# Altium schematic sheet PLEN_Control_Logic_pt1.SchDoc
size 594 x 840 mm; Author: ALTIUM GOSTBOM2.0 KEV
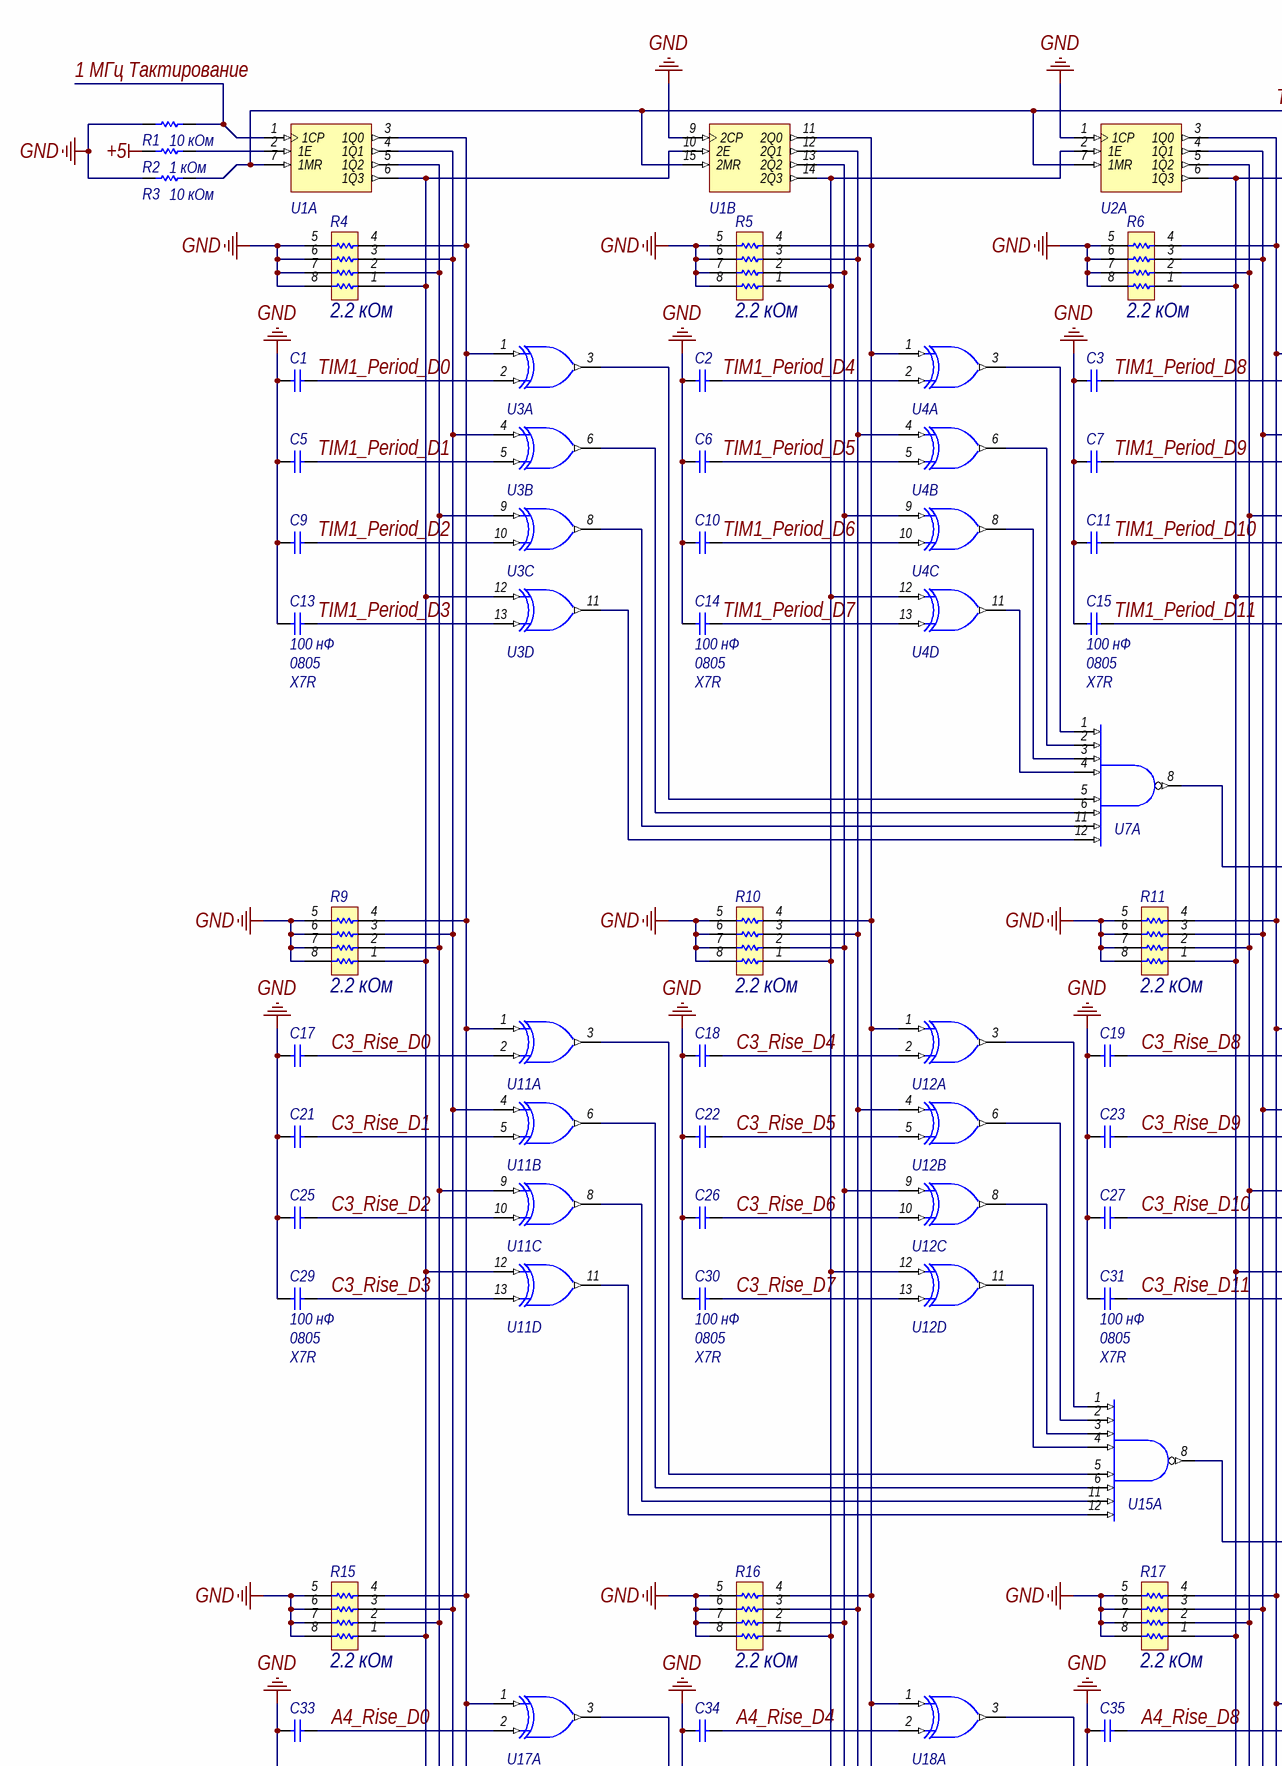
[diagram p0: PLEN_Control_Logic_pt1.SchDoc, top left]
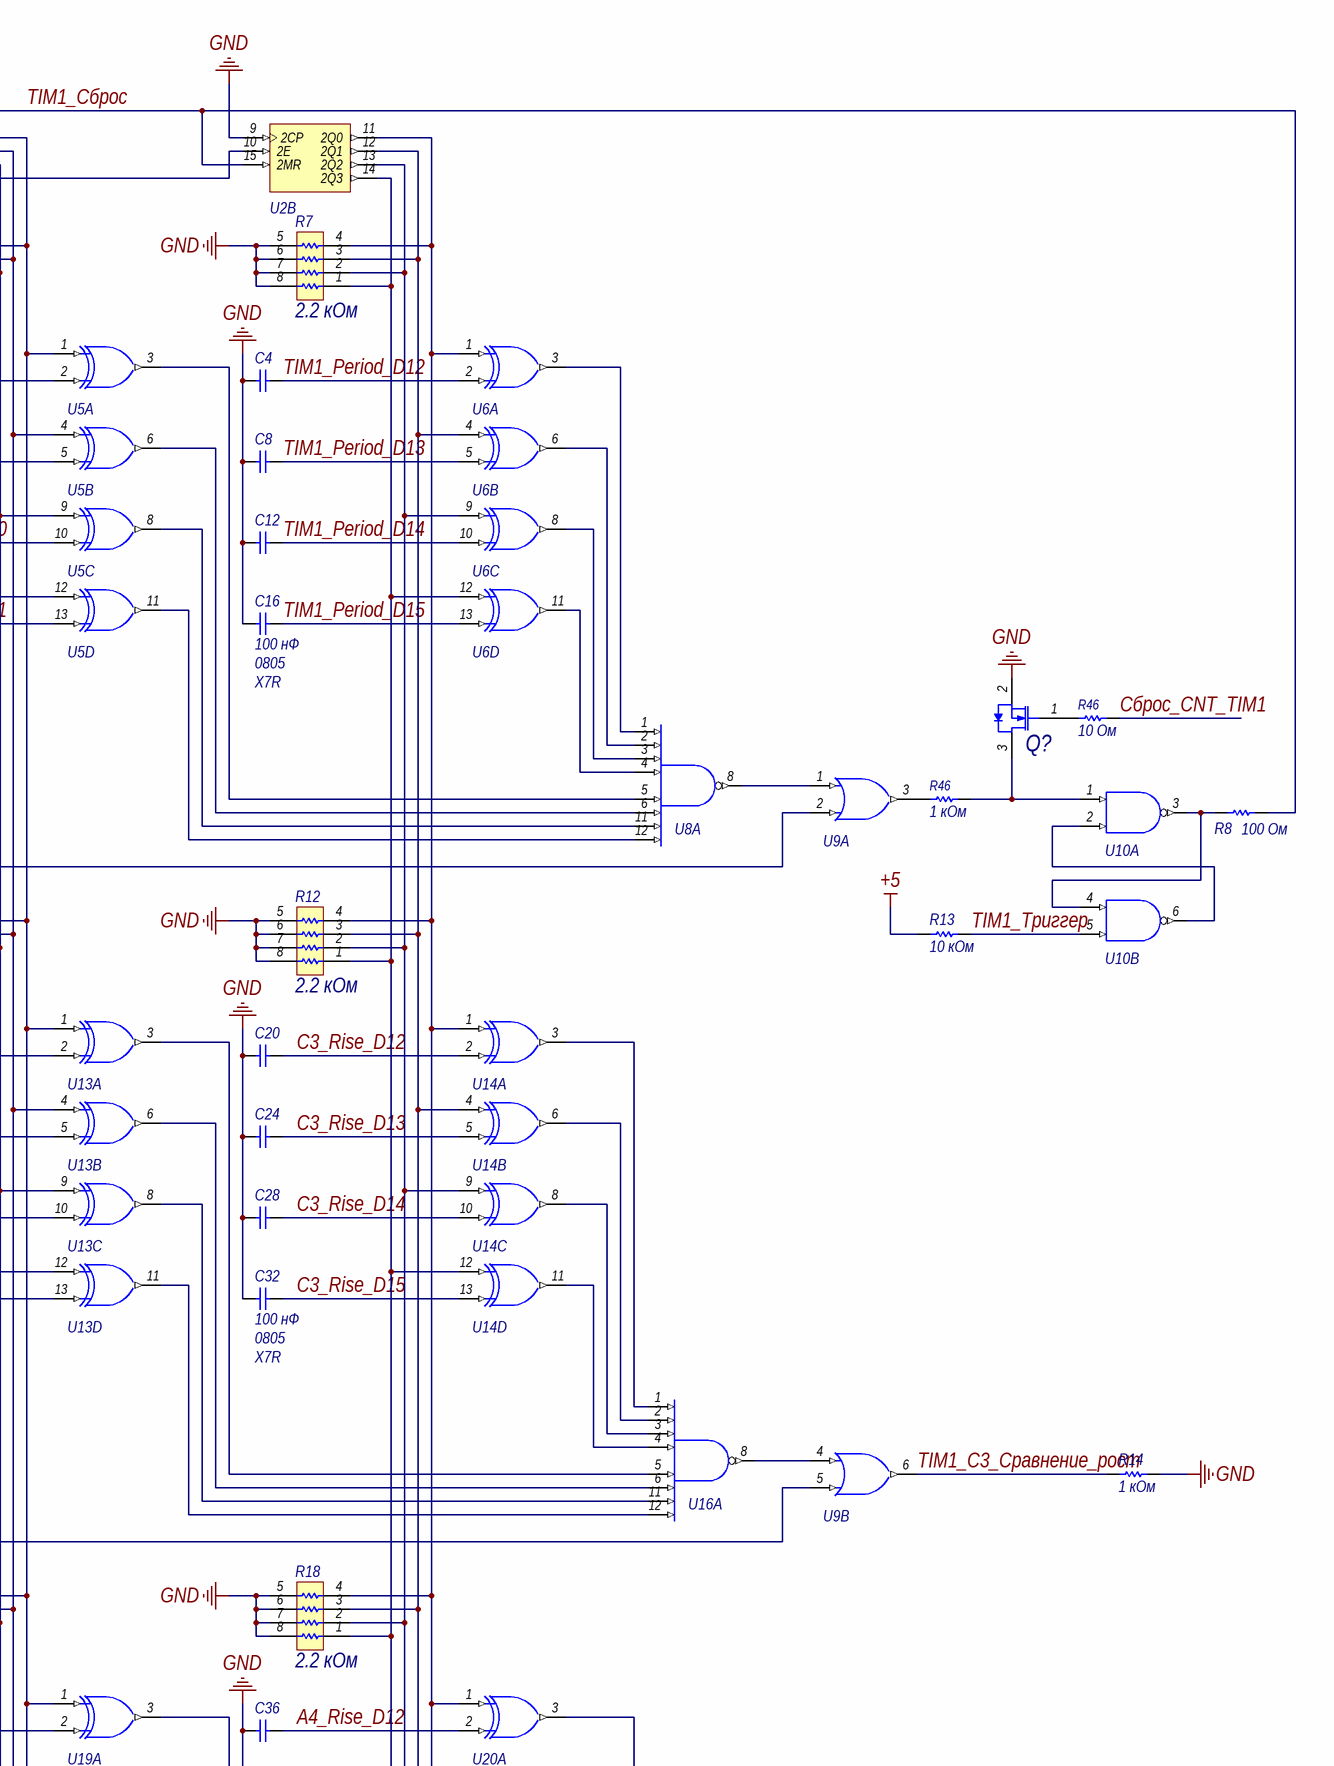
[diagram p1: PLEN_Control_Logic_pt1.SchDoc, top right]
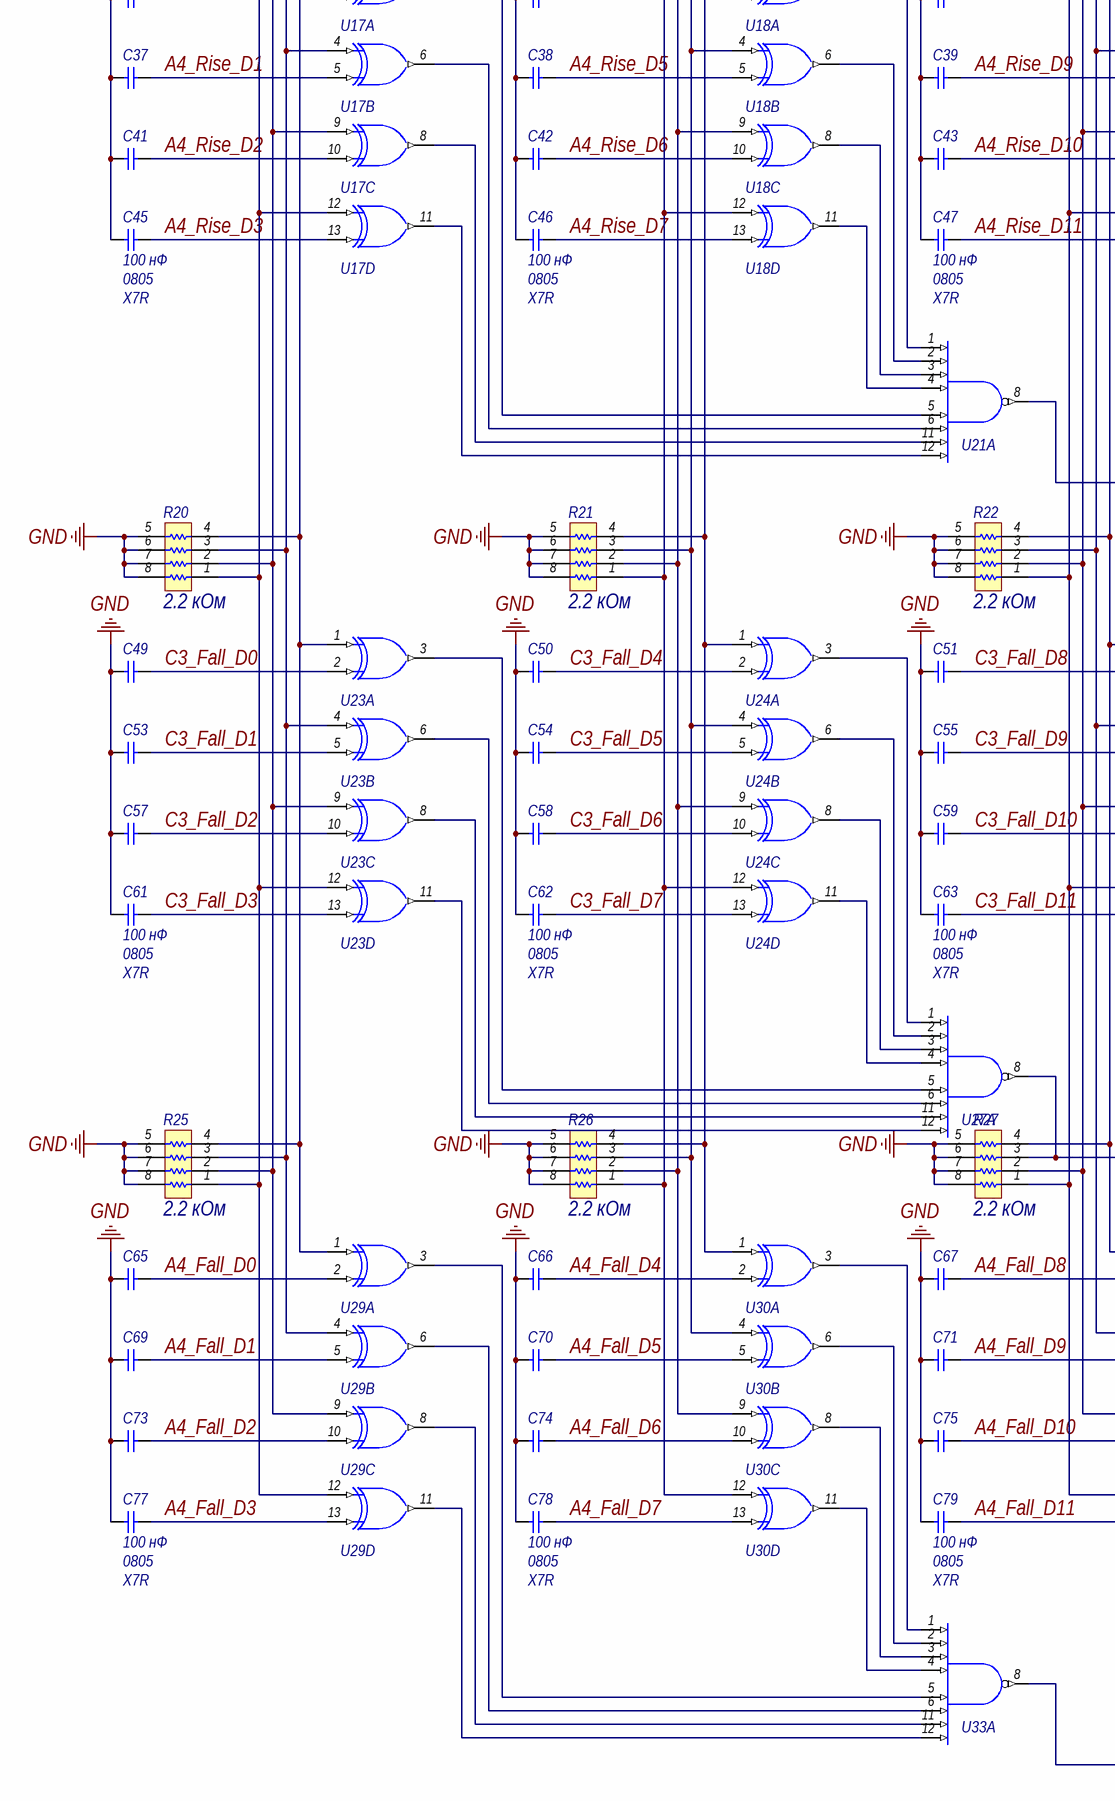
[diagram p2: PLEN_Control_Logic_pt1.SchDoc, bottom left]
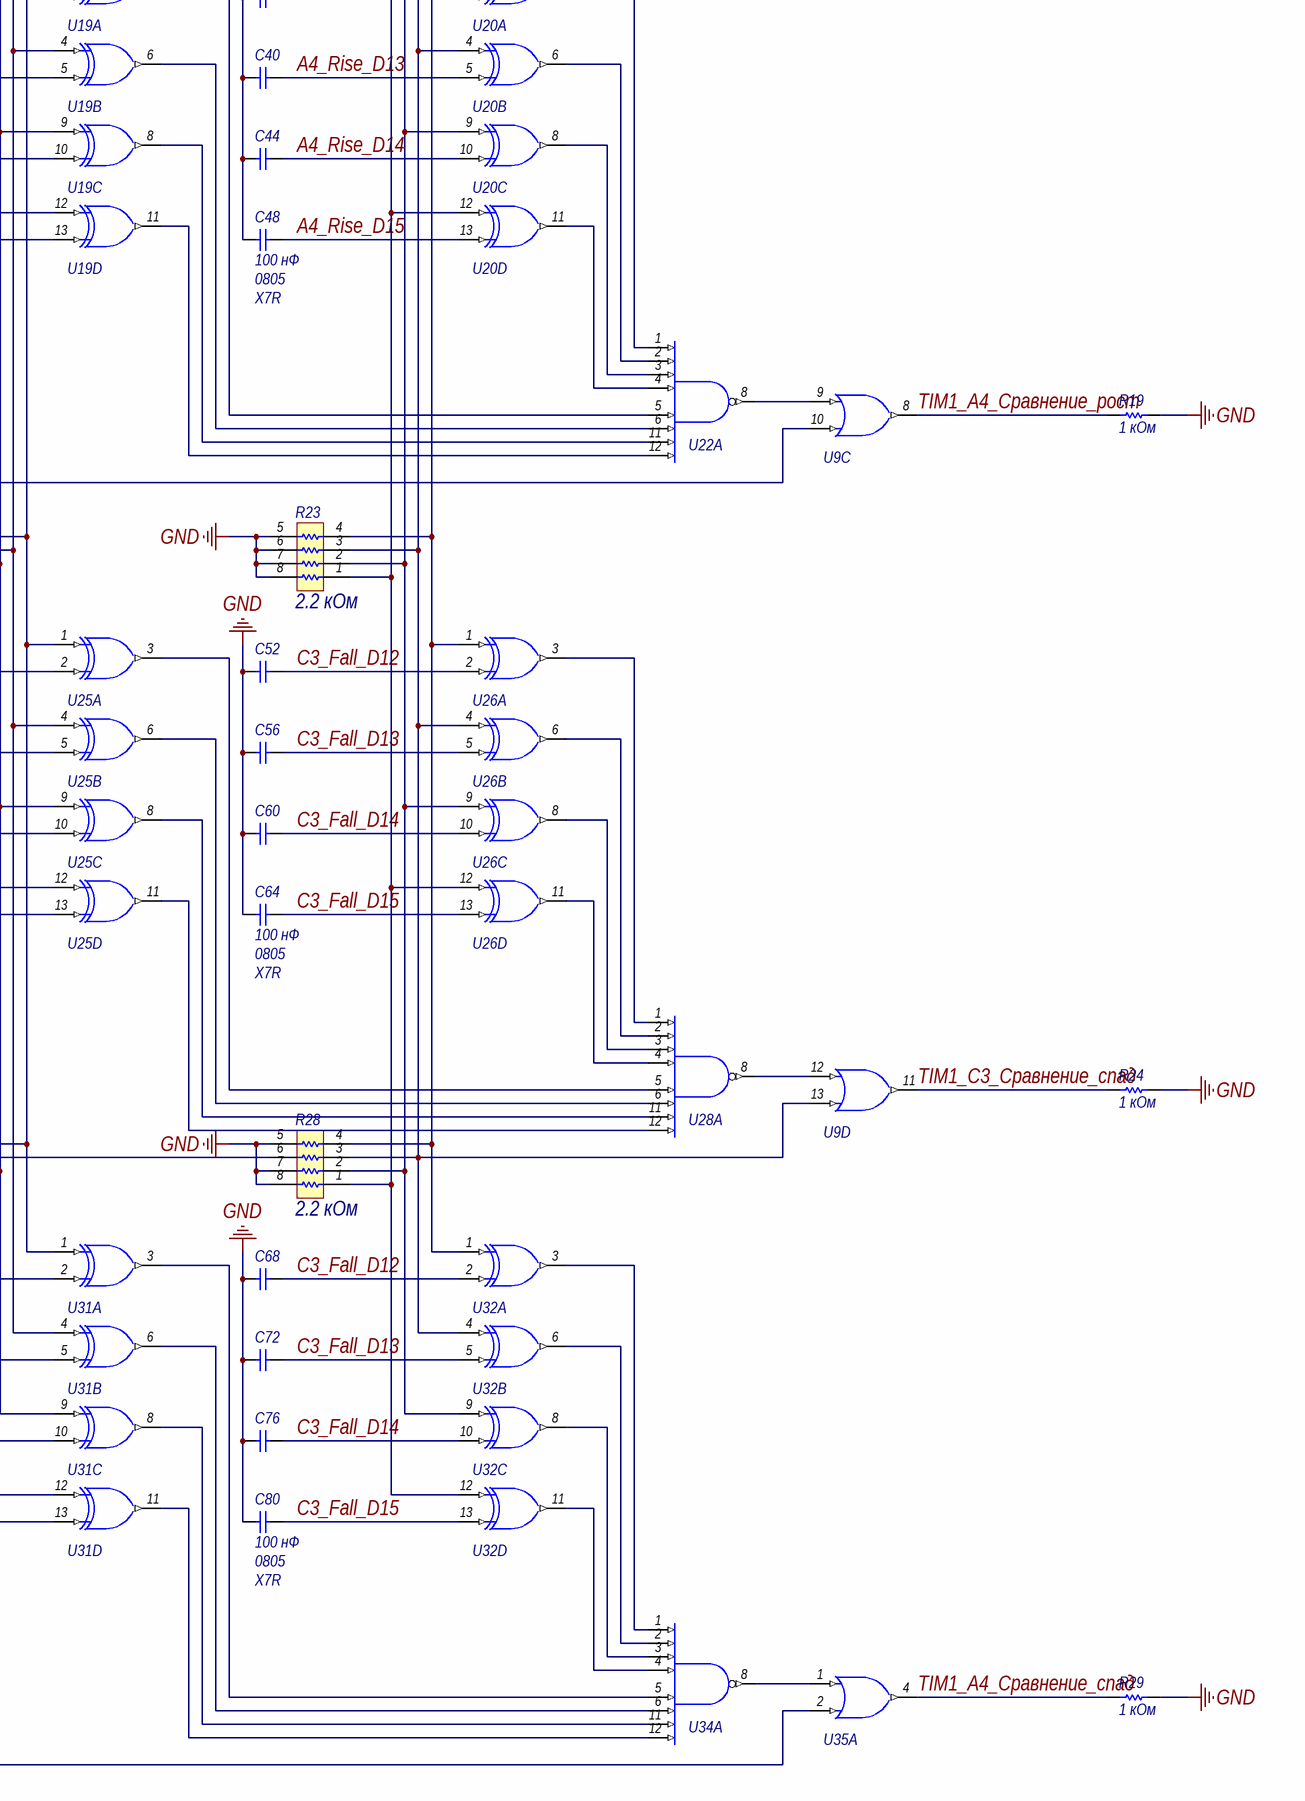
[diagram p3: PLEN_Control_Logic_pt1.SchDoc, bottom right]

## Parts
(Parts that share a designator on the sheet are numbered #1, #2 ... from top to bottom, then left to right.)
C1  C0805C105K3RACTU  [CAPC2013X140X50LL20T25]  (value not drawn)
C2  C0805C105K3RACTU  [CAPC2013X140X50LL20T25]  (value not drawn)
C3  C0805C105K3RACTU  [CAPC2013X140X50LL20T25]  (value not drawn)
C4  C0805C105K3RACTU  [CAPC2013X140X50LL20T25]  (value not drawn)
C5  C0805C105K3RACTU  [CAPC2013X140X50LL20T25]  (value not drawn)
C6  C0805C105K3RACTU  [CAPC2013X140X50LL20T25]  (value not drawn)
C7  C0805C105K3RACTU  [CAPC2013X140X50LL20T25]  (value not drawn)
C8  C0805C105K3RACTU  [CAPC2013X140X50LL20T25]  (value not drawn)
C9  C0805C105K3RACTU  [CAPC2013X140X50LL20T25]  (value not drawn)
C10  C0805C105K3RACTU  [CAPC2013X140X50LL20T25]  (value not drawn)
C11  C0805C105K3RACTU  [CAPC2013X140X50LL20T25]  (value not drawn)
C12  C0805C105K3RACTU  [CAPC2013X140X50LL20T25]  (value not drawn)
C13  value 100 нФ  Case: 0805  Dielectric: X7R  [CAPC2013X140X50LL20T25]  (hidden comment: C0805C105K3RACTU)
C14  value 100 нФ  Case: 0805  Dielectric: X7R  [CAPC2013X140X50LL20T25]  (hidden comment: C0805C105K3RACTU)
C15  value 100 нФ  Case: 0805  Dielectric: X7R  [CAPC2013X140X50LL20T25]  (hidden comment: C0805C105K3RACTU)
C16  value 100 нФ  Case: 0805  Dielectric: X7R  [CAPC2013X140X50LL20T25]  (hidden comment: C0805C105K3RACTU)
C17  C0805C105K3RACTU  [CAPC2013X140X50LL20T25]  (value not drawn)
C18  C0805C105K3RACTU  [CAPC2013X140X50LL20T25]  (value not drawn)
C19  C0805C105K3RACTU  [CAPC2013X140X50LL20T25]  (value not drawn)
C20  C0805C105K3RACTU  [CAPC2013X140X50LL20T25]  (value not drawn)
C21  C0805C105K3RACTU  [CAPC2013X140X50LL20T25]  (value not drawn)
C22  C0805C105K3RACTU  [CAPC2013X140X50LL20T25]  (value not drawn)
C23  C0805C105K3RACTU  [CAPC2013X140X50LL20T25]  (value not drawn)
C24  C0805C105K3RACTU  [CAPC2013X140X50LL20T25]  (value not drawn)
C25  C0805C105K3RACTU  [CAPC2013X140X50LL20T25]  (value not drawn)
C26  C0805C105K3RACTU  [CAPC2013X140X50LL20T25]  (value not drawn)
C27  C0805C105K3RACTU  [CAPC2013X140X50LL20T25]  (value not drawn)
C28  C0805C105K3RACTU  [CAPC2013X140X50LL20T25]  (value not drawn)
C29  value 100 нФ  Case: 0805  Dielectric: X7R  [CAPC2013X140X50LL20T25]  (hidden comment: C0805C105K3RACTU)
C30  value 100 нФ  Case: 0805  Dielectric: X7R  [CAPC2013X140X50LL20T25]  (hidden comment: C0805C105K3RACTU)
C31  value 100 нФ  Case: 0805  Dielectric: X7R  [CAPC2013X140X50LL20T25]  (hidden comment: C0805C105K3RACTU)
C32  value 100 нФ  Case: 0805  Dielectric: X7R  [CAPC2013X140X50LL20T25]  (hidden comment: C0805C105K3RACTU)
C33  C0805C105K3RACTU  [CAPC2013X140X50LL20T25]  (value not drawn)
C34  C0805C105K3RACTU  [CAPC2013X140X50LL20T25]  (value not drawn)
C35  C0805C105K3RACTU  [CAPC2013X140X50LL20T25]  (value not drawn)
C36  C0805C105K3RACTU  [CAPC2013X140X50LL20T25]  (value not drawn)
C37  C0805C105K3RACTU  [CAPC2013X140X50LL20T25]  (value not drawn)
C38  C0805C105K3RACTU  [CAPC2013X140X50LL20T25]  (value not drawn)
C39  C0805C105K3RACTU  [CAPC2013X140X50LL20T25]  (value not drawn)
C40  C0805C105K3RACTU  [CAPC2013X140X50LL20T25]  (value not drawn)
C41  C0805C105K3RACTU  [CAPC2013X140X50LL20T25]  (value not drawn)
C42  C0805C105K3RACTU  [CAPC2013X140X50LL20T25]  (value not drawn)
C43  C0805C105K3RACTU  [CAPC2013X140X50LL20T25]  (value not drawn)
C44  C0805C105K3RACTU  [CAPC2013X140X50LL20T25]  (value not drawn)
C45  value 100 нФ  Case: 0805  Dielectric: X7R  [CAPC2013X140X50LL20T25]  (hidden comment: C0805C105K3RACTU)
C46  value 100 нФ  Case: 0805  Dielectric: X7R  [CAPC2013X140X50LL20T25]  (hidden comment: C0805C105K3RACTU)
C47  value 100 нФ  Case: 0805  Dielectric: X7R  [CAPC2013X140X50LL20T25]  (hidden comment: C0805C105K3RACTU)
C48  value 100 нФ  Case: 0805  Dielectric: X7R  [CAPC2013X140X50LL20T25]  (hidden comment: C0805C105K3RACTU)
C49  C0805C105K3RACTU  [CAPC2013X140X50LL20T25]  (value not drawn)
C50  C0805C105K3RACTU  [CAPC2013X140X50LL20T25]  (value not drawn)
C51  C0805C105K3RACTU  [CAPC2013X140X50LL20T25]  (value not drawn)
C52  C0805C105K3RACTU  [CAPC2013X140X50LL20T25]  (value not drawn)
C53  C0805C105K3RACTU  [CAPC2013X140X50LL20T25]  (value not drawn)
C54  C0805C105K3RACTU  [CAPC2013X140X50LL20T25]  (value not drawn)
C55  C0805C105K3RACTU  [CAPC2013X140X50LL20T25]  (value not drawn)
C56  C0805C105K3RACTU  [CAPC2013X140X50LL20T25]  (value not drawn)
C57  C0805C105K3RACTU  [CAPC2013X140X50LL20T25]  (value not drawn)
C58  C0805C105K3RACTU  [CAPC2013X140X50LL20T25]  (value not drawn)
C59  C0805C105K3RACTU  [CAPC2013X140X50LL20T25]  (value not drawn)
C60  C0805C105K3RACTU  [CAPC2013X140X50LL20T25]  (value not drawn)
C61  value 100 нФ  Case: 0805  Dielectric: X7R  [CAPC2013X140X50LL20T25]  (hidden comment: C0805C105K3RACTU)
C62  value 100 нФ  Case: 0805  Dielectric: X7R  [CAPC2013X140X50LL20T25]  (hidden comment: C0805C105K3RACTU)
C63  value 100 нФ  Case: 0805  Dielectric: X7R  [CAPC2013X140X50LL20T25]  (hidden comment: C0805C105K3RACTU)
C64  value 100 нФ  Case: 0805  Dielectric: X7R  [CAPC2013X140X50LL20T25]  (hidden comment: C0805C105K3RACTU)
C65  C0805C105K3RACTU  [CAPC2013X140X50LL20T25]  (value not drawn)
C66  C0805C105K3RACTU  [CAPC2013X140X50LL20T25]  (value not drawn)
C67  C0805C105K3RACTU  [CAPC2013X140X50LL20T25]  (value not drawn)
C68  C0805C105K3RACTU  [CAPC2013X140X50LL20T25]  (value not drawn)
C69  C0805C105K3RACTU  [CAPC2013X140X50LL20T25]  (value not drawn)
C70  C0805C105K3RACTU  [CAPC2013X140X50LL20T25]  (value not drawn)
C71  C0805C105K3RACTU  [CAPC2013X140X50LL20T25]  (value not drawn)
C72  C0805C105K3RACTU  [CAPC2013X140X50LL20T25]  (value not drawn)
C73  C0805C105K3RACTU  [CAPC2013X140X50LL20T25]  (value not drawn)
C74  C0805C105K3RACTU  [CAPC2013X140X50LL20T25]  (value not drawn)
C75  C0805C105K3RACTU  [CAPC2013X140X50LL20T25]  (value not drawn)
C76  C0805C105K3RACTU  [CAPC2013X140X50LL20T25]  (value not drawn)
C77  value 100 нФ  Case: 0805  Dielectric: X7R  [CAPC2013X140X50LL20T25]  (hidden comment: C0805C105K3RACTU)
C78  value 100 нФ  Case: 0805  Dielectric: X7R  [CAPC2013X140X50LL20T25]  (hidden comment: C0805C105K3RACTU)
C79  value 100 нФ  Case: 0805  Dielectric: X7R  [CAPC2013X140X50LL20T25]  (hidden comment: C0805C105K3RACTU)
C80  value 100 нФ  Case: 0805  Dielectric: X7R  [CAPC2013X140X50LL20T25]  (hidden comment: C0805C105K3RACTU)
Q?  2N7002  [INF-PG-SOT23_N]  (value not drawn)
R1  value 10 кОм  [RESC2013X60X40ML20T25]  (hidden comment: ERA6AEB101V)
R2  value 1 кОм  [RESC2013X60X40ML20T25]  (hidden comment: ERA6AEB101V)
R3  value 10 кОм  [RESC2013X60X40ML20T25]  (hidden comment: ERA6AEB101V)
R4  value 2.2 кОм  [BOUR-CAT16-103J4LF_N]  (hidden comment: CAT16-103J4LF)
R5  value 2.2 кОм  [BOUR-CAT16-103J4LF_N]  (hidden comment: CAT16-103J4LF)
R6  value 2.2 кОм  [BOUR-CAT16-103J4LF_N]  (hidden comment: CAT16-103J4LF)
R7  value 2.2 кОм  [BOUR-CAT16-103J4LF_N]  (hidden comment: CAT16-103J4LF)
R8  value 100 Ом  [RESC2013X60X40ML20T25]  (hidden comment: ERA6AEB101V)
R9  value 2.2 кОм  [BOUR-CAT16-103J4LF_N]  (hidden comment: CAT16-103J4LF)
R10  value 2.2 кОм  [BOUR-CAT16-103J4LF_N]  (hidden comment: CAT16-103J4LF)
R11  value 2.2 кОм  [BOUR-CAT16-103J4LF_N]  (hidden comment: CAT16-103J4LF)
R12  value 2.2 кОм  [BOUR-CAT16-103J4LF_N]  (hidden comment: CAT16-103J4LF)
R13  value 10 кОм  [RESC2013X60X40ML20T25]  (hidden comment: ERA6AEB101V)
R14  value 1 кОм  [RESC2013X60X40ML20T25]  (hidden comment: ERA6AEB101V)
R15  value 2.2 кОм  [BOUR-CAT16-103J4LF_N]  (hidden comment: CAT16-103J4LF)
R16  value 2.2 кОм  [BOUR-CAT16-103J4LF_N]  (hidden comment: CAT16-103J4LF)
R17  value 2.2 кОм  [BOUR-CAT16-103J4LF_N]  (hidden comment: CAT16-103J4LF)
R18  value 2.2 кОм  [BOUR-CAT16-103J4LF_N]  (hidden comment: CAT16-103J4LF)
R19  value 1 кОм  [RESC2013X60X40ML20T25]  (hidden comment: ERA6AEB101V)
R20  value 2.2 кОм  [BOUR-CAT16-103J4LF_N]  (hidden comment: CAT16-103J4LF)
R21  value 2.2 кОм  [BOUR-CAT16-103J4LF_N]  (hidden comment: CAT16-103J4LF)
R22  value 2.2 кОм  [BOUR-CAT16-103J4LF_N]  (hidden comment: CAT16-103J4LF)
R23  value 2.2 кОм  [BOUR-CAT16-103J4LF_N]  (hidden comment: CAT16-103J4LF)
R24  value 1 кОм  [RESC2013X60X40ML20T25]  (hidden comment: ERA6AEB101V)
R25  value 2.2 кОм  [BOUR-CAT16-103J4LF_N]  (hidden comment: CAT16-103J4LF)
R26  value 2.2 кОм  [BOUR-CAT16-103J4LF_N]  (hidden comment: CAT16-103J4LF)
R27  value 2.2 кОм  [BOUR-CAT16-103J4LF_N]  (hidden comment: CAT16-103J4LF)
R28  value 2.2 кОм  [BOUR-CAT16-103J4LF_N]  (hidden comment: CAT16-103J4LF)
R29  value 1 кОм  [RESC2013X60X40ML20T25]  (hidden comment: ERA6AEB101V)
R46#1  value 10 Ом  [RESC2013X60X40ML20T25]  (hidden comment: ERA6AEB101V)
R46#2  value 1 кОм  [RESC2013X60X40ML20T25]  (hidden comment: ERA6AEB101V)
U1  CD74HC4520M  [D0016A_N]  (value not drawn)  (parts A,B of 3)
U2  CD74HC4520M  [D0016A_N]  (value not drawn)  (parts A,B of 3)
U3  SN74HC86D  [D0014A_N]  (value not drawn)  (parts A,B,C,D of 5)
U4  SN74HC86D  [D0014A_N]  (value not drawn)  (parts A,B,C,D of 5)
U5  SN74HC86D  [D0014A_N]  (value not drawn)  (parts A,B,C,D of 5)
U6  SN74HC86D  [D0014A_N]  (value not drawn)  (parts A,B,C,D of 5)
U7  CD74HC30M96  [D0014A_N]  (value not drawn)  (part A of 2)
U8  CD74HC30M96  [D0014A_N]  (value not drawn)  (part A of 2)
U9  SN74HC32DR  [D0014A_N]  (value not drawn)  (parts A,B,C,D of 5)
U10  SN74HC00DT  [D0014A_N]  (value not drawn)  (parts A,B of 5)
U11  SN74HC86D  [D0014A_N]  (value not drawn)  (parts A,B,C,D of 5)
U12  SN74HC86D  [D0014A_N]  (value not drawn)  (parts A,B,C,D of 5)
U13  SN74HC86D  [D0014A_N]  (value not drawn)  (parts A,B,C,D of 5)
U14  SN74HC86D  [D0014A_N]  (value not drawn)  (parts A,B,C,D of 5)
U15  CD74HC30M96  [D0014A_N]  (value not drawn)  (part A of 2)
U16  CD74HC30M96  [D0014A_N]  (value not drawn)  (part A of 2)
U17  SN74HC86D  [D0014A_N]  (value not drawn)  (parts A,B,C,D of 5)
U18  SN74HC86D  [D0014A_N]  (value not drawn)  (parts A,B,C,D of 5)
U19  SN74HC86D  [D0014A_N]  (value not drawn)  (parts A,B,C,D of 5)
U20  SN74HC86D  [D0014A_N]  (value not drawn)  (parts A,B,C,D of 5)
U21  CD74HC30M96  [D0014A_N]  (value not drawn)  (part A of 2)
U22  CD74HC30M96  [D0014A_N]  (value not drawn)  (part A of 2)
U23  SN74HC86D  [D0014A_N]  (value not drawn)  (parts A,B,C,D of 5)
U24  SN74HC86D  [D0014A_N]  (value not drawn)  (parts A,B,C,D of 5)
U25  SN74HC86D  [D0014A_N]  (value not drawn)  (parts A,B,C,D of 5)
U26  SN74HC86D  [D0014A_N]  (value not drawn)  (parts A,B,C,D of 5)
U27  CD74HC30M96  [D0014A_N]  (value not drawn)  (part A of 2)
U28  CD74HC30M96  [D0014A_N]  (value not drawn)  (part A of 2)
U29  SN74HC86D  [D0014A_N]  (value not drawn)  (parts A,B,C,D of 5)
U30  SN74HC86D  [D0014A_N]  (value not drawn)  (parts A,B,C,D of 5)
U31  SN74HC86D  [D0014A_N]  (value not drawn)  (parts A,B,C,D of 5)
U32  SN74HC86D  [D0014A_N]  (value not drawn)  (parts A,B,C,D of 5)
U33  CD74HC30M96  [D0014A_N]  (value not drawn)  (part A of 2)
U34  CD74HC30M96  [D0014A_N]  (value not drawn)  (part A of 2)
U35  SN74AHCT1G32DBVR  [DBV0005A_N]  (value not drawn)  (part A of 2)

## Nets
+5: R2.2 R13.1
GND: C1.2 C2.2 C3.2 C4.2 C5.2 C6.2 C7.2 C8.2 C9.2 C10.2 C11.2 C12.2 C13.2 C14.2 C15.2 C16.2 C17.2 C18.2 C19.2 C20.2 C21.2 C22.2 C23.2 C24.2 C25.2 C26.2 C27.2 C28.2 C29.2 C30.2 C31.2 C32.2 C33.2 C34.2 C35.2 C36.2 C37.2 C38.2 C39.2 C40.2 C41.2 C42.2 C43.2 C44.2 C45.2 C46.2 C47.2 C48.2 C49.2 C50.2 C51.2 C52.2 C53.2 C54.2 C55.2 C56.2 C57.2 C58.2 C59.2 C60.2 C61.2 C62.2 C63.2 C64.2 C65.2 C66.2 C67.2 C68.2 C69.2 C70.2 C71.2 C72.2 C73.2 C74.2 C75.2 C76.2 C77.2 C78.2 C79.2 C80.2 Q?.2(SOURCE) R1.2 R3.2 R4.5 R4.6 R4.7 R4.8 R5.5 R5.6 R5.7 R5.8 R6.5 R6.6 R6.7 R6.8 R7.5 R7.6 R7.7 R7.8 R9.5 R9.6 R9.7 R9.8 R10.5 R10.6 R10.7 R10.8 R11.5 R11.6 R11.7 R11.8 R12.5 R12.6 R12.7 R12.8 R14.2 R15.5 R15.6 R15.7 R15.8 R16.5 R16.6 R16.7 R16.8 R17.5 R17.6 R17.7 R17.8 R18.5 R18.6 R18.7 R18.8 R19.2 R20.5 R20.6 R20.7 R20.8 R21.5 R21.6 R21.7 R21.8 R22.5 R22.6 R22.7 R22.8 R23.5 R23.6 R23.7 R23.8 R24.2 R25.5 R25.6 R25.7 R25.8 R26.5 R26.6 R26.7 R26.8 R27.5 R27.6 R27.7 R27.8 R28.5 R28.7 R28.8 R29.2 U1.9(2CP) U2.1(1CP) U2.9(2CP)
1 МГц Тактирование: R1.1 U1.1(1CP)
A4_Rise_D0: C33.1 U17.2(1B)
A4_Rise_D1: C37.1 U17.5(2B)
A4_Rise_D2: C41.1 U17.10(3B)
A4_Rise_D3: C45.1 U17.13(4B)
A4_Rise_D4: C34.1 U18.2(1B)
A4_Rise_D5: C38.1 U18.5(2B)
A4_Rise_D6: C42.1 U18.10(3B)
A4_Rise_D7: C46.1 U18.13(4B)
A4_Rise_D8: C35.1 U19.2(1B)
A4_Rise_D9: C39.1 U19.5(2B)
A4_Rise_D10: C43.1 U19.10(3B)
A4_Rise_D11: C47.1 U19.13(4B)
A4_Rise_D12: C36.1 U20.2(1B)
A4_Rise_D13: C40.1 U20.5(2B)
A4_Rise_D14: C44.1 U20.10(3B)
A4_Rise_D15: C48.1 U20.13(4B)
C3_Rise_D0: C17.1 U11.2(1B)
C3_Rise_D1: C21.1 U11.5(2B)
C3_Rise_D2: C25.1 U11.10(3B)
C3_Rise_D3: C29.1 U11.13(4B)
C3_Rise_D4: C18.1 U12.2(1B)
C3_Rise_D5: C22.1 U12.5(2B)
C3_Rise_D6: C26.1 U12.10(3B)
C3_Rise_D7: C30.1 U12.13(4B)
C3_Rise_D8: C19.1 U13.2(1B)
C3_Rise_D9: C23.1 U13.5(2B)
C3_Rise_D10: C27.1 U13.10(3B)
C3_Rise_D11: C31.1 U13.13(4B)
C3_Rise_D12: C20.1 U14.2(1B)
C3_Rise_D13: C24.1 U14.5(2B)
C3_Rise_D14: C28.1 U14.10(3B)
C3_Rise_D15: C32.1 U14.13(4B)
TIM1_A4_Сравнение_рост: R19.1 U9.8(3Y)
TIM1_C3_Сравнение_рост: R14.1 U9.6(2Y)
TIM1_Period_D0: C1.1 U3.2(1B)
TIM1_Period_D1: C5.1 U3.5(2B)
TIM1_Period_D2: C9.1 U3.10(3B)
TIM1_Period_D3: C13.1 U3.13(4B)
TIM1_Period_D4: C2.1 U4.2(1B)
TIM1_Period_D5: C6.1 U4.5(2B)
TIM1_Period_D6: C10.1 U4.10(3B)
TIM1_Period_D7: C14.1 U4.13(4B)
TIM1_Period_D8: C3.1 U5.2(1B)
TIM1_Period_D9: C7.1 U5.5(2B)
TIM1_Period_D10: C11.1 U5.10(3B)
TIM1_Period_D11: C15.1 U5.13(4B)
TIM1_Period_D12: C4.1 U6.2(1B)
TIM1_Period_D13: C8.1 U6.5(2B)
TIM1_Period_D14: C12.1 U6.10(3B)
TIM1_Period_D15: C16.1 U6.13(4B)
TIM1_А4_Сравнение_спад: R29.1 U35.4(Y)
TIM1_С3_Сравнение_спад: R24.1 U9.11(4Y)
TIM1_Сброс: R3.1 R8.1 U1.7(1MR) U1.15(2MR) U2.7(1MR) U2.15(2MR)
TIM1_Триггер: R13.2 U10.5(2B)
А4_Fall_D0: C65.1 U29.2(1B)
А4_Fall_D1: C69.1 U29.5(2B)
А4_Fall_D2: C73.1 U29.10(3B)
А4_Fall_D3: C77.1 U29.13(4B)
А4_Fall_D4: C66.1 U30.2(1B)
А4_Fall_D5: C70.1 U30.5(2B)
А4_Fall_D6: C74.1 U30.10(3B)
А4_Fall_D7: C78.1 U30.13(4B)
А4_Fall_D8: C67.1 U31.2(1B)
А4_Fall_D9: C71.1 U31.5(2B)
А4_Fall_D10: C75.1 U31.10(3B)
А4_Fall_D11: C79.1 U31.13(4B)
С3_Fall_D0: C49.1 U23.2(1B)
С3_Fall_D1: C53.1 U23.5(2B)
С3_Fall_D2: C57.1 U23.10(3B)
С3_Fall_D3: C61.1 U23.13(4B)
С3_Fall_D4: C50.1 U24.2(1B)
С3_Fall_D5: C54.1 U24.5(2B)
С3_Fall_D6: C58.1 U24.10(3B)
С3_Fall_D7: C62.1 U24.13(4B)
С3_Fall_D8: C51.1 U25.2(1B)
С3_Fall_D9: C55.1 U25.5(2B)
С3_Fall_D10: C59.1 U25.10(3B)
С3_Fall_D11: C63.1 U25.13(4B)
С3_Fall_D12: C52.1 C68.1 U26.2(1B) U32.2(1B)
С3_Fall_D13: C56.1 C72.1 U26.5(2B) U32.5(2B)
С3_Fall_D14: C60.1 C76.1 U26.10(3B) U32.10(3B)
С3_Fall_D15: C64.1 C80.1 U26.13(4B) U32.13(4B)
Сброс_CNT_TIM1: R46#1.1
NetQ?_1: Q?.1(GATE) R46#1.2
NetQ?_3: Q?.3(DRAIN) R46#2.2 U10.1(1A)
NetR2_1: R2.1 U1.2(1E)
NetR4_1: R4.1 R9.1 R15.1 R20.1 R25.1 U1.6(1Q3) U1.10(2E) U3.12(4A) U11.12(4A) U17.12(4A) U23.12(4A) U29.12(4A)
NetR4_2: R4.2 R9.2 R15.2 R20.2 R25.2 U1.5(1Q2) U3.9(3A) U11.9(3A) U17.9(3A) U23.9(3A) U29.9(3A)
NetR4_3: R4.3 R9.3 R15.3 R20.3 R25.3 U1.4(1Q1) U3.4(2A) U11.4(2A) U17.4(2A) U23.4(2A) U29.4(2A)
NetR4_4: R4.4 R9.4 R15.4 R20.4 R25.4 U1.3(1Q0) U3.1(1A) U11.1(1A) U17.1(1A) U23.1(1A) U29.1(1A)
NetR5_1: R5.1 R10.1 R16.1 R21.1 R26.1 U1.14(2Q3) U2.2(1E) U4.12(4A) U12.12(4A) U18.12(4A) U24.12(4A) U30.12(4A)
NetR5_2: R5.2 R10.2 R16.2 R21.2 R26.2 U1.13(2Q2) U4.9(3A) U12.9(3A) U18.9(3A) U24.9(3A) U30.9(3A)
NetR5_3: R5.3 R10.3 R16.3 R21.3 R26.3 U1.12(2Q1) U4.4(2A) U12.4(2A) U18.4(2A) U24.4(2A) U30.4(2A)
NetR5_4: R5.4 R10.4 R16.4 R21.4 R26.4 U1.11(2Q0) U4.1(1A) U12.1(1A) U18.1(1A) U24.1(1A) U30.1(1A)
NetR6_1: R6.1 R11.1 R17.1 R22.1 R27.1 U2.6(1Q3) U2.10(2E) U5.12(4A) U13.12(4A) U19.12(4A) U25.12(4A) U31.12(4A)
NetR6_2: R6.2 R11.2 R17.2 R22.2 R27.2 U2.5(1Q2) U5.9(3A) U13.9(3A) U19.9(3A) U25.9(3A) U31.9(3A)
NetR6_3: R6.3 R11.3 R17.3 R22.3 U2.4(1Q1) U5.4(2A) U13.4(2A) U19.4(2A) U25.4(2A) U31.4(2A)
NetR6_4: R6.4 R11.4 R17.4 R22.4 R27.4 U2.3(1Q0) U5.1(1A) U13.1(1A) U19.1(1A) U25.1(1A) U31.1(1A)
NetR7_1: R7.1 R12.1 R18.1 R23.1 R28.1 U2.14(2Q3) U6.12(4A) U14.12(4A) U20.12(4A) U26.12(4A) U32.12(4A)
NetR7_2: R7.2 R12.2 R18.2 R23.2 R28.2 U2.13(2Q2) U6.9(3A) U14.9(3A) U20.9(3A) U26.9(3A) U32.9(3A)
NetR7_3: R7.3 R12.3 R18.3 R23.3 R28.3 U2.12(2Q1) U6.4(2A) U9.13(4B) U14.4(2A) U20.4(2A) U26.4(2A) U32.4(2A)
NetR7_4: R7.4 R12.4 R18.4 R23.4 R28.4 U2.11(2Q0) U6.1(1A) U14.1(1A) U20.1(1A) U26.1(1A) U32.1(1A)
NetR8_2: R8.2 U10.3(1Y) U10.4(2A)
NetR27_3: R27.3 R28.6 U27.8(~{Y})
NetR46#2_1: R46#2.1 U9.3(1Y)
NetU3_3: U3.3(1Y) U7.5(E)
NetU3_6: U3.6(2Y) U7.6(F)
NetU3_8: U3.8(3Y) U7.11(G)
NetU3_11: U3.11(4Y) U7.12(H)
NetU4_3: U4.3(1Y) U7.1(A)
NetU4_6: U4.6(2Y) U7.2(B)
NetU4_8: U4.8(3Y) U7.3(C)
NetU4_11: U4.11(4Y) U7.4(D)
NetU5_3: U5.3(1Y) U8.5(E)
NetU5_6: U5.6(2Y) U8.6(F)
NetU5_8: U5.8(3Y) U8.11(G)
NetU5_11: U5.11(4Y) U8.12(H)
NetU6_3: U6.3(1Y) U8.1(A)
NetU6_6: U6.6(2Y) U8.2(B)
NetU6_8: U6.8(3Y) U8.3(C)
NetU6_11: U6.11(4Y) U8.4(D)
NetU7_8: U7.8(~{Y}) U9.2(1B)
NetU8_8: U8.8(~{Y}) U9.1(1A)
NetU9_4: U9.4(2A) U16.8(~{Y})
NetU9_5: U9.5(2B) U15.8(~{Y})
NetU9_9: U9.9(3A) U22.8(~{Y})
NetU9_10: U9.10(3B) U21.8(~{Y})
NetU9_12: U9.12(4A) U28.8(~{Y})
NetU10_2: U10.2(1B) U10.6(2Y)
NetU11_3: U11.3(1Y) U15.5(E)
NetU11_6: U11.6(2Y) U15.6(F)
NetU11_8: U11.8(3Y) U15.11(G)
NetU11_11: U11.11(4Y) U15.12(H)
NetU12_3: U12.3(1Y) U15.1(A)
NetU12_6: U12.6(2Y) U15.2(B)
NetU12_8: U12.8(3Y) U15.3(C)
NetU12_11: U12.11(4Y) U15.4(D)
NetU13_3: U13.3(1Y) U16.5(E)
NetU13_6: U13.6(2Y) U16.6(F)
NetU13_8: U13.8(3Y) U16.11(G)
NetU13_11: U13.11(4Y) U16.12(H)
NetU14_3: U14.3(1Y) U16.1(A)
NetU14_6: U14.6(2Y) U16.2(B)
NetU14_8: U14.8(3Y) U16.3(C)
NetU14_11: U14.11(4Y) U16.4(D)
NetU17_3: U17.3(1Y) U21.5(E)
NetU17_6: U17.6(2Y) U21.6(F)
NetU17_8: U17.8(3Y) U21.11(G)
NetU17_11: U17.11(4Y) U21.12(H)
NetU18_3: U18.3(1Y) U21.1(A)
NetU18_6: U18.6(2Y) U21.2(B)
NetU18_8: U18.8(3Y) U21.3(C)
NetU18_11: U18.11(4Y) U21.4(D)
NetU19_3: U19.3(1Y) U22.5(E)
NetU19_6: U19.6(2Y) U22.6(F)
NetU19_8: U19.8(3Y) U22.11(G)
NetU19_11: U19.11(4Y) U22.12(H)
NetU20_3: U20.3(1Y) U22.1(A)
NetU20_6: U20.6(2Y) U22.2(B)
NetU20_8: U20.8(3Y) U22.3(C)
NetU20_11: U20.11(4Y) U22.4(D)
NetU23_3: U23.3(1Y) U27.5(E)
NetU23_6: U23.6(2Y) U27.6(F)
NetU23_8: U23.8(3Y) U27.11(G)
NetU23_11: U23.11(4Y) U27.12(H)
NetU24_3: U24.3(1Y) U27.1(A)
NetU24_6: U24.6(2Y) U27.2(B)
NetU24_8: U24.8(3Y) U27.3(C)
NetU24_11: U24.11(4Y) U27.4(D)
NetU25_3: U25.3(1Y) U28.5(E)
NetU25_6: U25.6(2Y) U28.6(F)
NetU25_8: U25.8(3Y) U28.11(G)
NetU25_11: U25.11(4Y) U28.12(H)
NetU26_3: U26.3(1Y) U28.1(A)
NetU26_6: U26.6(2Y) U28.2(B)
NetU26_8: U26.8(3Y) U28.3(C)
NetU26_11: U26.11(4Y) U28.4(D)
NetU29_3: U29.3(1Y) U33.5(E)
NetU29_6: U29.6(2Y) U33.6(F)
NetU29_8: U29.8(3Y) U33.11(G)
NetU29_11: U29.11(4Y) U33.12(H)
NetU30_3: U30.3(1Y) U33.1(A)
NetU30_6: U30.6(2Y) U33.2(B)
NetU30_8: U30.8(3Y) U33.3(C)
NetU30_11: U30.11(4Y) U33.4(D)
NetU31_3: U31.3(1Y) U34.5(E)
NetU31_6: U31.6(2Y) U34.6(F)
NetU31_8: U31.8(3Y) U34.11(G)
NetU31_11: U31.11(4Y) U34.12(H)
NetU32_3: U32.3(1Y) U34.1(A)
NetU32_6: U32.6(2Y) U34.2(B)
NetU32_8: U32.8(3Y) U34.3(C)
NetU32_11: U32.11(4Y) U34.4(D)
NetU33_8: U33.8(~{Y}) U35.2(B)
NetU34_8: U34.8(~{Y}) U35.1(A)

## Notes on the sheet
- Перв. примен.
- Справ. №
- Подп. дата
- Инв. № дубл.
- Взам. инв. №
- Подп. и дата
- Изм.
- Разраб.
- Лист
- № докум.
- Подп.
- Дата
- Лит.
- Масса
- Масштаб
- Пров.
- Т.контр.
- Листов
- Инв. № подл.
- Н.контр.
- Утв.
- ALTIUM GOSTBOM2.0 KEV
- Файл:
- Копировал
- Формат А1

## Library data of the parts
C1-C12 C17-C28 C33-C44 C49-C60 C65-C76 = CMP-2007-03234-1: Manufacturer: Kemet; Value: 100 нФ; Dielectric: X7R; Part Number: C0805C105K3RACTU; Case: 0805
C13-C16 C29-C32 C45-C48 C61-C64 C77-C80 = CMP-2007-03234-1: Manufacturer: Kemet; Part Number: C0805C105K3RACTU
Q? = CMP-1149-00026-1: N-Channel OptiMOS Small-Signal-Transistor, 60 V VDS, 0.3 A ID, -55 to 150 degC, PG-SOT23, Reel, Green; Manufacturer: Infineon; RDS (on) (max) (@4.5V): 4,000 mOhm; VDS (max): 60 V; IDpuls (max): 1.2Â A; QG: 0.4Â nC; RDS (on) (max): 3,000 mOhm; RthJA (max): 250 K/W; ID (max): 0.3Â A; VGS(th) (max): 2.5Â V; VGS(th) (min): 1.5Â V; Green: TRUE; Ptot (max): 0.5Â W; PackageDescription: 3-Pin Small Outline Transistor Package, 2.9 x 1.3 mm Body, 0.95 mm Pitch; Halogen-free: TRUE; ComponentLink2Description: Datasheet; ComponentLink1URL: http://www.infineon.com/; Packing: Reel; DatasheetVersion: Rev. 2.4; PartNumber: 2N7002; PackageReference: PG-SOT23; PackageVersion: Apr-08; ComponentLink3URL: http://www.infineon.com/dgdl/SOT23-Package_Overview.pdf?folderId=db3a30431936bc4b0119532290053c66&fileId=db3a30431936bc4b0119533468123c85; ComponentLink1Description: Manufacturer URL; Mounting Technology: Surface Mount; ComponentLink3Description: Package Specification; ComponentLink2URL: http://www.infineon.com/dgdl/2N7002_Rev2.4.pdf?folderId=db3a3043156fd573011622e10b5c1f67&fileId=db3a304319bc939a0119c2a9461e79e6
R1-R3 R8 R13 R14 R19 R24 R29 R46#1 R46#2 = CMP-2001-00580-1: Manufacturer: Panasonic; Part Number: ERA6AEB101V
R4-R7 R9-R12 R15-R18 R20-R23 R25-R28 = CMP-2000-06067-1: CAT / CAY 16 Series - Chip Resistor Array, 10 KOhm, +/- 5%, 50 V, -55 to 125 degC, 8-Pin SMD, RoHS, Tape and Reel; Manufacturer: Bourns; Power Per Element: 62.5mW; Online Catalog: CAT16Series; Number of Resistors: 4; EDA / CAD Models: DownloadfromAcceleratedDesigns; Temperature Coefficient: ±200ppm/°C; Circuit Type: Isolated; Other Names: CAT16-103J4LFDKR; Package Reference: CAT16-103J4LF; Datasheet Version: 09/2014; Series: CAT16; Manufacturer URL: http://www.bourns.com/; Mounting Type: SurfaceMount; Datasheet URL: http://www.mouser.com/ds/2/54/ATCAY-777361.pdf; Category: Resistors; Height: 0.024"(0.60mm); Mounting Technology: SurfaceMount; Applications: -; Size / Dimension: 0.126"Lx0.061"W(3.20mmx1.55mm); Packaging: Digi-Reel®; Package / Case: 1206(3216Metric),Concave,LongSideTerminals; Supplier Device Package: 1206; RoHS Information: CAT16MaterialDeclaration; Number of Pins: 8; Family: ResistorNetworks,Arrays; Standard Package: 1; Package Description: 8-Pin Surface Mount Device, Body 3.2 x 1.55 mm, Pitch 0.8 mm; Operating Temperature: -55°C~125°C; Tolerance: ±5%
U1 U2 = CMP-1623-00119-2: High Speed CMOS Logic Dual Binary Up-Counters, D0016A, TUBE; Manufacturer: Texas Instruments; VCC(Min)(V): 2; tpd @ Nom Voltage(Max)(ns): 51; Inputs: 1; Voltage(Nom)(V): 6; Output Drive (IOL/IOH)(Max)(mA): 5.2/-5.2; Technology Family: HC; Rating: Military; ICC @ Nom Voltage(Max)(mA): 0.08; Bits(#): 4; F @ Nom Voltage(Max)(Mhz): 28; Generic Part Number: CD74HC4520; Type: Binary; PackageReference: D0016A; DatasheetVersion: SCHS216D; Operating Temperature Range(C): -55 to 125; Code_JEDEC: MS-012 variation AC; Function: Counter; VCC(Max)(V): 6
U3-U6 U11-U14 U17-U20 U23-U26 U29-U32 = CMP-0778-00002-3: Quadruple 2-Input Exclusive-OR Gates, D0014A, TUBE; Manufacturer: Texas Instruments; Input Type: CMOS; Technology Family: HC; Rating: Catalog; Schmitt Trigger: No; Bits(#): 4; tpd @ Nom Voltage(Max)(ns): 21; VCC(Max)(V): 6; Output Drive (IOL/IOH)(Max)(mA): 5.2/-5.2; VCC(Min)(V): 2; ICC @ Nom Voltage(Max)(mA): 0.02; Voltage(Nom)(V): 5; F @ Nom Voltage(Max)(Mhz): 70; PackageReference: D0014A; DatasheetVersion: SCLS100E; Generic Part Number: SN74HC86; Output Type: CMOS; Operating Temperature Range(C): -40 to 85
U7 U8 U15 U16 U21 U22 U27 U28 U33 U34 = CMP-1627-00017-2: High Speed CMOS Logic 8-Input NAND Gate, D0014A, LARGE T&R; Manufacturer: Texas Instruments; Output Drive (IOL/IOH)(Max)(mA): 4/-4; Bits(#): 1; VCC(Min)(V): 2; F @ Nom Voltage(Max)(Mhz): 70; Rating: Catalog; tpd @ Nom Voltage(Max)(ns): 28; Schmitt Trigger: No; Voltage(Nom)(V): 5; ICC @ Nom Voltage(Max)(mA): 0.02; Technology Family: HC; VCC(Max)(V): 6; DatasheetVersion: SCHS121D; Operating Temperature Range(C): -55 to 125; Output Type: CMOS; Generic Part Number: CD74HC30; Input Type: CMOS; PackageReference: D0014A; Code_JEDEC: MS-012
U9 = CMP-1573-00006-3: Quadruple 2-Input Positive-OR Gates, D0014A, LARGE T&R; Manufacturer: Texas Instruments; Bits(#): 4; VCC(Max)(V): 6; F @ Nom Voltage(Max)(Mhz): 70; ICC @ Nom Voltage(Max)(mA): 0.02; Input Type: CMOS; Voltage(Nom)(V): 5; tpd @ Nom Voltage(Max)(ns): 25; Output Drive (IOL/IOH)(Max)(mA): 5.2/-5.2; Rating: Catalog; VCC(Min)(V): 2; Generic Part Number: SN74HC32; PackageReference: D0014A; DatasheetVersion: SCLS200D; Operating Temperature Range(C): -40 to 85; Output Type: CMOS; Code_JEDEC: MS-012; PackageVersion: http://www.ti.com/lit/ml/mpds177g/mpds177g.pdf
U10 = CMP-1627-00178-2: Quad 2-Input Positive-NAND Gates, D0014A, SMALL T&R; Manufacturer: Texas Instruments; Rating: Catalog; F @ Nom Voltage(Max)(Mhz): 70; VCC(Max)(V): 6; tpd @ Nom Voltage(Max)(ns): 23; VCC(Min)(V): 2; Schmitt Trigger: Yes; Output Drive (IOL/IOH)(Max)(mA): 5.2/-5.2; Voltage(Nom)(V): 5; Technology Family: HC; Output Type: CMOS; Bits(#): 4; ICC @ Nom Voltage(Max)(mA): 0.02; Operating Temperature Range(C): -40 to 85; DatasheetVersion: SCLS181E; PackageReference: D0014A; Code_JEDEC: MS-012; Generic Part Number: SN74HC00; Input Type: CMOS
U35 = CMP-0859-00067-3: Single 2-Input Positive-OR Gate, DBV0005A, LARGE T&R; Manufacturer: Texas Instruments; Technology Family: AHCT; VCC(Min)(V): 2; Voltage(Nom)(V): 5; Schmitt Trigger: No; Gate Type: OR; Sub-Family: OR Gate; Input Type: CMOS; ICC @ Nom Voltage(Max)(mA): 0.01; VCC(Max)(V): 5.5; Bits(#): 1; F @ Nom Voltage(Max)(Mhz): 75; Output Drive (IOL/IOH)(Max)(mA): 8/-8; tpd @ Nom Voltage(Max)(ns): 8; Logic: True; Rating: Catalog; Operating Temperature Range(C): -40 to 125; Generic Part Number: SN74AHCT1G32; DatasheetVersion: SCLS320O; PackageReference: DBV0005A; 3-State Output: No; Output Type: CMOS